# Altium schematic sheet Notes.SchDoc
size A; SheetNumber: 6; SheetTotal: 6
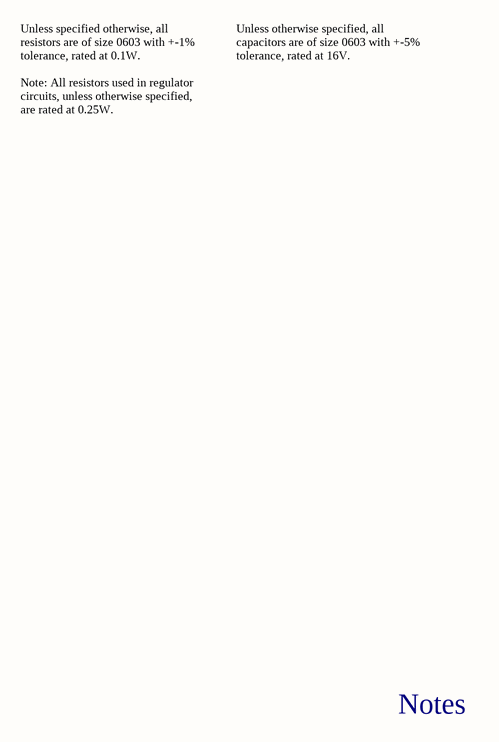
[diagram p0: Notes.SchDoc]

## Notes on the sheet
- Unless specified otherwise, all resistors are of size 0603 with +-1% tolerance, rated at 0.1W.
  Note: All resistors used in regulator circuits, unless otherwise specified, are rated at 0.25W.
- Unless otherwise specified, all capacitors are of size 0603 with +-5% tolerance, rated at 16V.
- Notes